# Altium schematic sheet OpenPLCv0.2.0_USBPortTypeB.SchDoc
size 420 x 297 mm; PageSetup: Record=PageOptions|CenterHorizontal=True|CenterVertical=True|PrintScale=1.01|XCorrection=1.00|YCorrection=1.00|PrintKind=1|BorderSize=5000000|LeftOffset=0|BottomOffset=0|Orientation=2|PaperLength=1000|PaperWidth=1000|Scale=100|PaperSource=7|PrintQuality=-4|MediaType=1|DitherType=10|PaperKind=A3|PrintScaleMode=1; DocumentNumber: 16; SheetNumber: 16; SheetTotal: 22; SheetTitle: USB Type-B
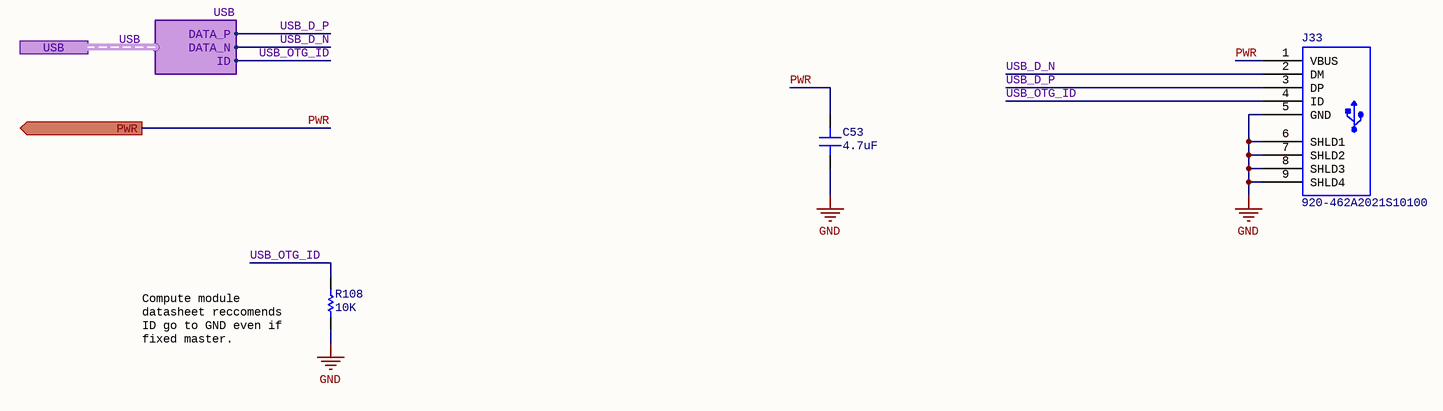
[diagram p0: OpenPLCv0.2.0_USBPortTypeB.SchDoc]

## Parts
C53  Capacitance: 4.7uF  [SMD_CAP_0603(0201)_N]  (hidden comment: CC0603KRX5R6BB475)
J33  920-462A2021S10100  [920-462A2021S10100]
R108  Resistance: 10K  [SMD_RES_0402(1005)_N]  (hidden comment: RC0402FR-0710KL)

## Ports
PWR (out), USB (harness USB)

## Harnesses
USB: DATA_P, DATA_N, ID

## Nets
GND: C53.1 J33.5(GND) J33.6(SHLD1) J33.7(SHLD2) J33.8(SHLD3) J33.9(SHLD4) R108.1
PWR: C53.2 J33.1(VBUS) ; port PWR
USB_D_N: J33.2(DM) ; port USB.DATA_N  [project net USB.DATA_N]
USB_D_P: J33.3(DP) ; port USB.DATA_P  [project net USB.DATA_P]
USB_OTG_ID: J33.4(ID) R108.2 ; port USB.ID  [project net USB.ID]

## Buses and harness runs
harness USB = port USB

## Notes on the sheet
- (near R108) Compute module datasheet reccomends ID go to GND even if fixed master.
- FILE NAME
- PROJECT
- TITLE
- REV
- AUTHOR
- SIZE
- SHEET
- DATE
- OF
- A3

## Library data of the parts
C53 = 4.7uF 0603 10V 10%: 4.7uF ±10% 10V X5R 0603 Multilayer Ceramic Capacitors MLCC - SMD/SMT RoHS; Package: 0603; Tolerance: 10%; Voltage Rating: 10V
J33 = 920-462A2021S10100: USB - Mini B Female USB 2 5 SMD USB Connectors RoHS
R108 = 10K 0402 1% 1/16W: 10kΩ ±1% 1/16W ±100ppm/℃ 0402 Chip Resistor - Surface Mount RoHS; Package: 0402; Tolerance: 1%; Power Rating: 1/16W